# EAGLE design RELAY16 (EAGLE 9.3.1)
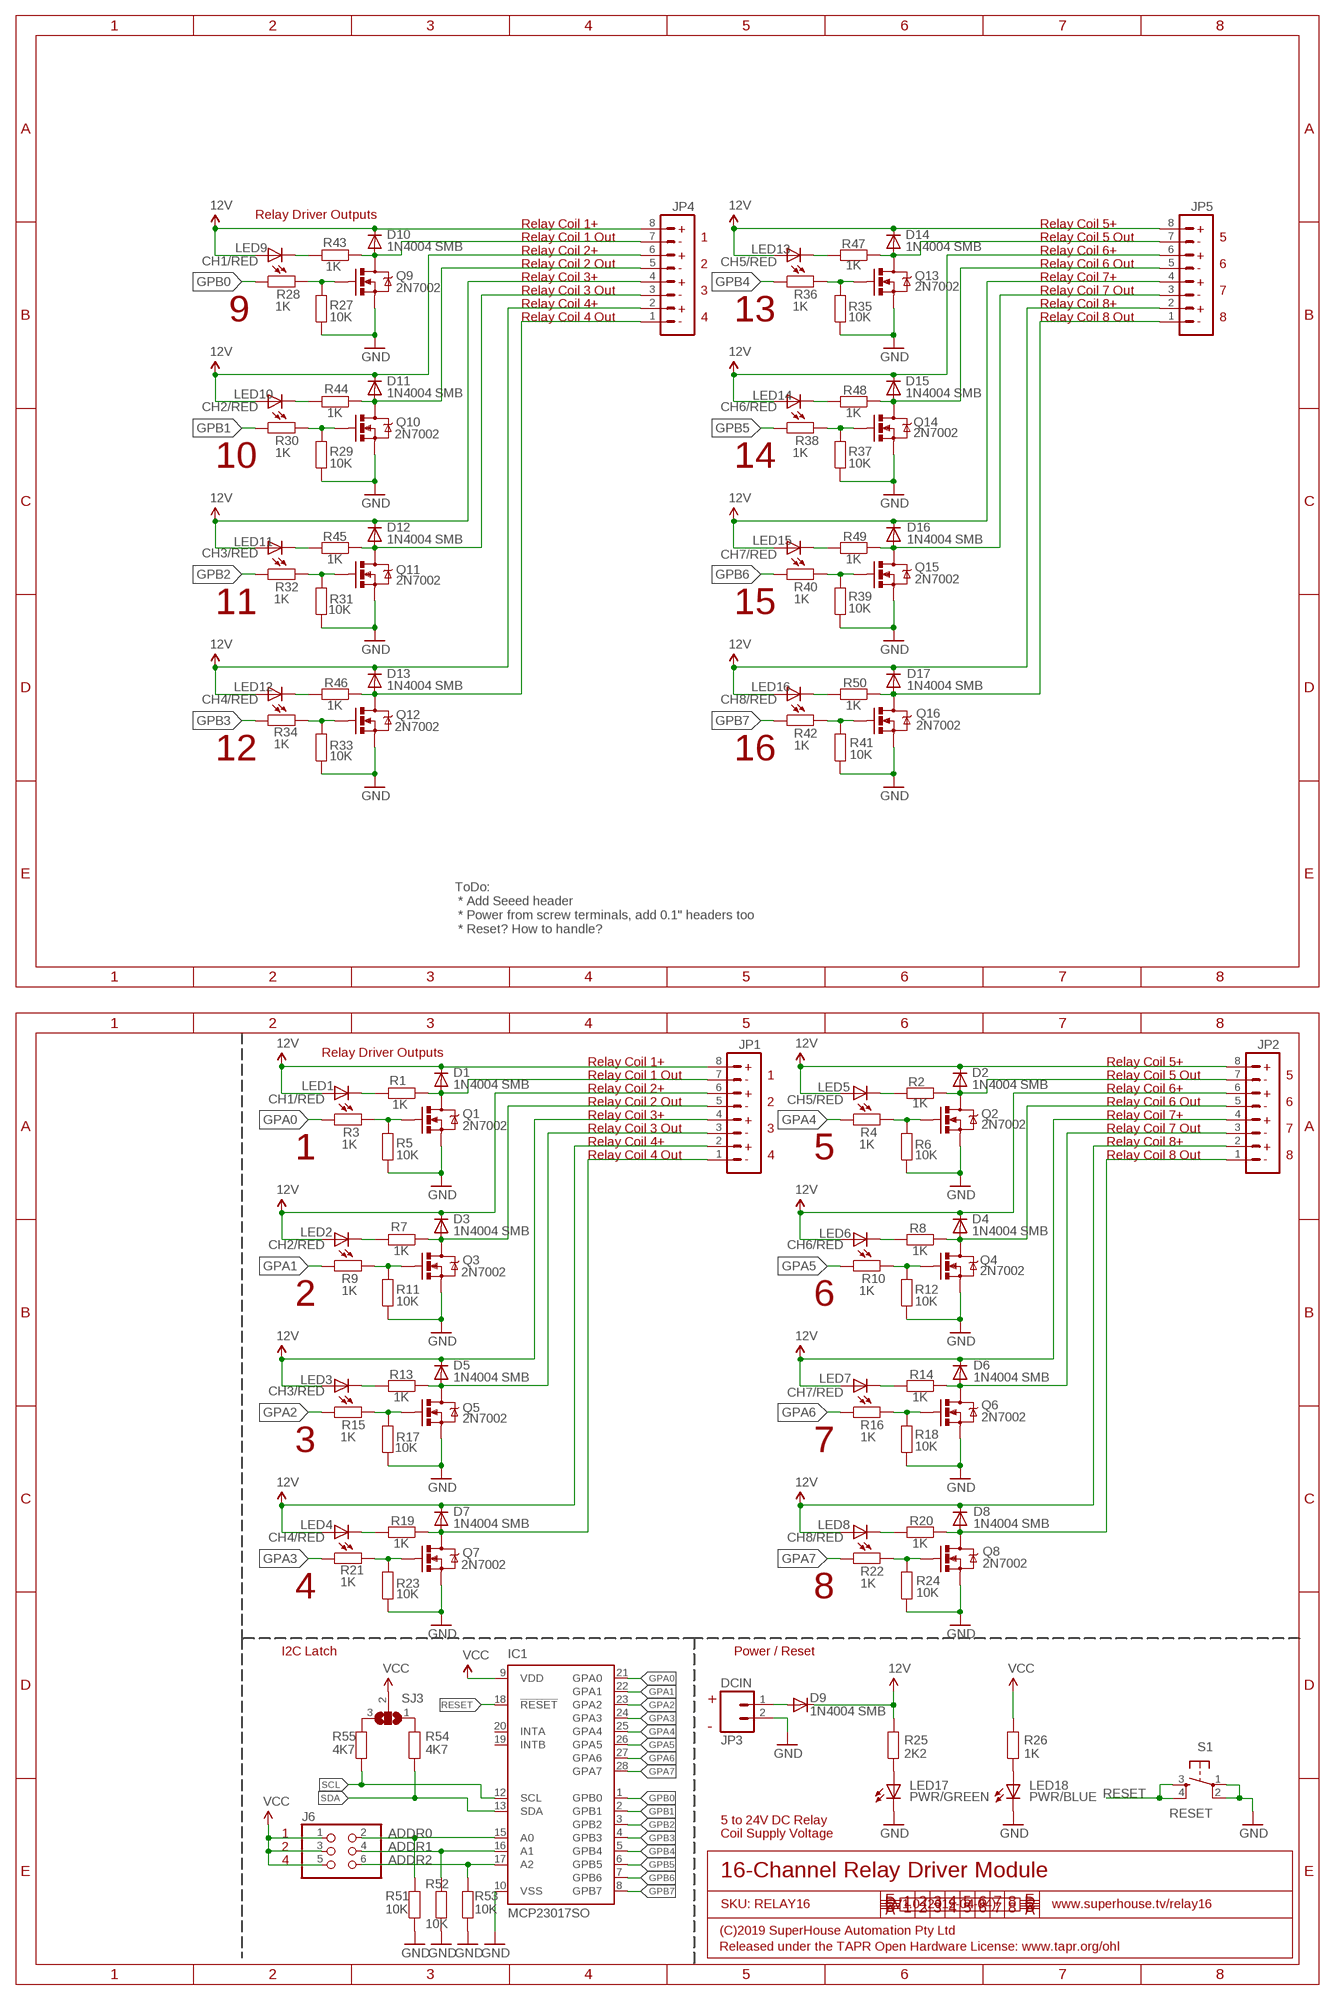
[diagram p0: schematic, sheet 1]

## Parts
D1  1N4004 SMB  DIODESMB  [SMB-DIODE]
D2  1N4004 SMB  DIODESMB  [SMB-DIODE]
D3  1N4004 SMB  DIODESMB  [SMB-DIODE]
D4  1N4004 SMB  DIODESMB  [SMB-DIODE]
D5  1N4004 SMB  DIODESMB  [SMB-DIODE]
D6  1N4004 SMB  DIODESMB  [SMB-DIODE]
D7  1N4004 SMB  DIODESMB  [SMB-DIODE]
D8  1N4004 SMB  DIODESMB  [SMB-DIODE]
D9  1N4004 SMB  DIODESMB  [SMB-DIODE]
D10  1N4004 SMB  DIODESMB  [SMB-DIODE]
D11  1N4004 SMB  DIODESMB  [SMB-DIODE]
D12  1N4004 SMB  DIODESMB  [SMB-DIODE]
D13  1N4004 SMB  DIODESMB  [SMB-DIODE]
D14  1N4004 SMB  DIODESMB  [SMB-DIODE]
D15  1N4004 SMB  DIODESMB  [SMB-DIODE]
D16  1N4004 SMB  DIODESMB  [SMB-DIODE]
D17  1N4004 SMB  DIODESMB  [SMB-DIODE]
IC1  MCP23017SO  [SO28W]
J6  PINHD-2X3  [2X03]
JP1  M08  [TERMINALBLOCK_3.5MM_8]
JP2  M08  [TERMINALBLOCK_3.5MM_8]
JP3  DCIN  M023.5MM  [SCREWTERMINAL-3.5MM-2]
JP4  M08  [TERMINALBLOCK_3.5MM_8]
JP5  M08  [TERMINALBLOCK_3.5MM_8]
LED1  CH1/RED  LED0603  [LED-0603]
LED2  CH2/RED  LED0603  [LED-0603]
LED3  CH3/RED  LED0603  [LED-0603]
LED4  CH4/RED  LED0603  [LED-0603]
LED5  CH5/RED  LED0603  [LED-0603]
LED6  CH6/RED  LED0603  [LED-0603]
LED7  CH7/RED  LED0603  [LED-0603]
LED8  CH8/RED  LED0603  [LED-0603]
LED9  CH1/RED  LED0603  [LED-0603]
LED10  CH2/RED  LED0603  [LED-0603]
LED11  CH3/RED  LED0603  [LED-0603]
LED12  CH4/RED  LED0603  [LED-0603]
LED13  CH5/RED  LED0603  [LED-0603]
LED14  CH6/RED  LED0603  [LED-0603]
LED15  CH7/RED  LED0603  [LED-0603]
LED16  CH8/RED  LED0603  [LED-0603]
LED17  PWR/GREEN  LED0603  [LED-0603]
LED18  PWR/BLUE  LED0603  [LED-0603]
Q1  2N7002  MOSFET-NCHANNELSMD  [SOT23-3]
Q2  2N7002  MOSFET-NCHANNELSMD  [SOT23-3]
Q3  2N7002  MOSFET-NCHANNELSMD  [SOT23-3]
Q4  2N7002  MOSFET-NCHANNELSMD  [SOT23-3]
Q5  2N7002  MOSFET-NCHANNELSMD  [SOT23-3]
Q6  2N7002  MOSFET-NCHANNELSMD  [SOT23-3]
Q7  2N7002  MOSFET-NCHANNELSMD  [SOT23-3]
Q8  2N7002  MOSFET-NCHANNELSMD  [SOT23-3]
Q9  2N7002  MOSFET-NCHANNELSMD  [SOT23-3]
Q10  2N7002  MOSFET-NCHANNELSMD  [SOT23-3]
Q11  2N7002  MOSFET-NCHANNELSMD  [SOT23-3]
Q12  2N7002  MOSFET-NCHANNELSMD  [SOT23-3]
Q13  2N7002  MOSFET-NCHANNELSMD  [SOT23-3]
Q14  2N7002  MOSFET-NCHANNELSMD  [SOT23-3]
Q15  2N7002  MOSFET-NCHANNELSMD  [SOT23-3]
Q16  2N7002  MOSFET-NCHANNELSMD  [SOT23-3]
R1  1K  RESISTOR0603  [0603]
R2  1K  RESISTOR0603  [0603]
R3  1K  RESISTOR0603  [0603]
R4  1K  RESISTOR0603  [0603]
R5  10K  RESISTOR0603  [0603]
R6  10K  RESISTOR0603  [0603]
R7  1K  RESISTOR0603  [0603]
R8  1K  RESISTOR0603  [0603]
R9  1K  RESISTOR0603  [0603]
R10  1K  RESISTOR0603  [0603]
R11  10K  RESISTOR0603  [0603]
R12  10K  RESISTOR0603  [0603]
R13  1K  RESISTOR0603  [0603]
R14  1K  RESISTOR0603  [0603]
R15  1K  RESISTOR0603  [0603]
R16  1K  RESISTOR0603  [0603]
R17  10K  RESISTOR0603  [0603]
R18  10K  RESISTOR0603  [0603]
R19  1K  RESISTOR0603  [0603]
R20  1K  RESISTOR0603  [0603]
R21  1K  RESISTOR0603  [0603]
R22  1K  RESISTOR0603  [0603]
R23  10K  RESISTOR0603  [0603]
R24  10K  RESISTOR0603  [0603]
R25  2K2  RESISTOR0603  [0603]
R26  1K  RESISTOR0603  [0603]
R27  10K  RESISTOR0603  [0603]
R28  1K  RESISTOR0603  [0603]
R29  10K  RESISTOR0603  [0603]
R30  1K  RESISTOR0603  [0603]
R31  10K  RESISTOR0603  [0603]
R32  1K  RESISTOR0603  [0603]
R33  10K  RESISTOR0603  [0603]
R34  1K  RESISTOR0603  [0603]
R35  10K  RESISTOR0603  [0603]
R36  1K  RESISTOR0603  [0603]
R37  10K  RESISTOR0603  [0603]
R38  1K  RESISTOR0603  [0603]
R39  10K  RESISTOR0603  [0603]
R40  1K  RESISTOR0603  [0603]
R41  10K  RESISTOR0603  [0603]
R42  1K  RESISTOR0603  [0603]
R43  1K  RESISTOR0603  [0603]
R44  1K  RESISTOR0603  [0603]
R45  1K  RESISTOR0603  [0603]
R46  1K  RESISTOR0603  [0603]
R47  1K  RESISTOR0603  [0603]
R48  1K  RESISTOR0603  [0603]
R49  1K  RESISTOR0603  [0603]
R50  1K  RESISTOR0603  [0603]
R51  10K  RESISTOR0603  [0603]
R52  10K  RESISTOR0603  [0603]
R53  10K  RESISTOR0603  [0603]
R54  4K7  RESISTOR0603  [0603]
R55  4K7  RESISTOR0603  [0603]
S1  RESET  TAC_SWITCHSMD  [TACTILE_SWITCH_SMD]
SJ3  SJ2W  [SJ_2]

## Nets
12V: D1.C D2.C D3.C D4.C D5.C D6.C D7.C D8.C D9.C D10.C D11.C D12.C D13.C D14.C D15.C D16.C D17.C JP1.2 JP1.4 JP1.6 JP1.8 JP2.2 JP2.4 JP2.6 JP2.8 JP4.2 JP4.4 JP4.6 JP4.8 JP5.2 JP5.4 JP5.6 JP5.8 LED1.A LED2.A LED3.A LED4.A LED5.A LED6.A LED7.A LED8.A LED9.A LED10.A LED11.A LED12.A LED13.A LED14.A LED15.A LED16.A R25.2
ADDR0: IC1.15(A0) J6.2 R51.2
ADDR1: IC1.16(A1) J6.4 R52.2
ADDR2: IC1.17(A2) J6.6 R53.2
GND: IC1.10(VSS) JP3.2 LED17.C LED18.C Q1.2(S) Q2.2(S) Q3.2(S) Q4.2(S) Q5.2(S) Q6.2(S) Q7.2(S) Q8.2(S) Q9.2(S) Q10.2(S) Q11.2(S) Q12.2(S) Q13.2(S) Q14.2(S) Q15.2(S) Q16.2(S) R5.1 R6.1 R11.1 R12.1 R17.1 R18.1 R23.1 R24.1 R27.1 R29.1 R31.1 R33.1 R35.1 R37.1 R39.1 R41.1 R51.1 R52.1 R53.1 S1.1 S1.2
GPA0: IC1.21(GPA0) R3.2
GPA1: IC1.22(GPA1) R9.2
GPA2: IC1.23(GPA2) R15.2
GPA3: IC1.24(GPA3) R21.2
GPA4: IC1.25(GPA4) R4.2
GPA5: IC1.26(GPA5) R10.2
GPA6: IC1.27(GPA6) R16.2
GPA7: IC1.28(GPA7) R22.2
GPB0: IC1.1(GPB0) R28.2
GPB1: IC1.2(GPB1) R30.2
GPB2: IC1.3(GPB2) R32.2
GPB3: IC1.4(GPB3) R34.2
GPB4: IC1.5(GPB4) R36.2
GPB5: IC1.6(GPB5) R38.2
GPB6: IC1.7(GPB6) R40.2
GPB7: IC1.8(GPB7) R42.2
IOREF: IC1.9(VDD) J6.1 J6.3 J6.5 R26.2 SJ3.2 ; supply symbol labelled VCC
N$1: Q1.1(G) R3.1 R5.2
N$2: R55.2 SJ3.3
N$3: D3.A JP1.5 Q3.3(D) R7.2
N$4: LED17.A R25.1
N$5: D1.A JP1.7 Q1.3(D) R1.2
N$6: R54.2 SJ3.1
N$8: Q3.1(G) R9.1 R11.2
N$9: D5.A JP1.3 Q5.3(D) R13.2
N$10: Q5.1(G) R15.1 R17.2
N$11: D7.A JP1.1 Q7.3(D) R19.2
N$12: Q7.1(G) R21.1 R23.2
N$13: D2.A JP2.7 Q2.3(D) R2.2
N$14: Q2.1(G) R4.1 R6.2
N$15: D4.A JP2.5 Q4.3(D) R8.2
N$16: Q4.1(G) R10.1 R12.2
N$17: D6.A JP2.3 Q6.3(D) R14.2
N$18: Q6.1(G) R16.1 R18.2
N$19: D8.A JP2.1 Q8.3(D) R20.2
N$20: Q8.1(G) R22.1 R24.2
N$21: LED2.C R7.1
N$22: LED4.C R19.1
N$23: LED3.C R13.1
N$24: LED1.C R1.1
N$25: LED5.C R2.1
N$26: LED6.C R8.1
N$27: LED7.C R14.1
N$28: LED8.C R20.1
N$41: D9.A JP3.1
N$42: D10.A JP4.7 Q9.3(D) R43.2
N$43: Q9.1(G) R27.2 R28.1
N$47: D11.A JP4.5 Q10.3(D) R44.2
N$48: Q10.1(G) R29.2 R30.1
N$50: D12.A JP4.3 Q11.3(D) R45.2
N$51: Q11.1(G) R31.2 R32.1
N$52: LED18.A R26.1
N$53: D13.A JP4.1 Q12.3(D) R46.2
N$54: Q12.1(G) R33.2 R34.1
N$55: D14.A JP5.7 Q13.3(D) R47.2
N$56: Q13.1(G) R35.2 R36.1
N$57: D15.A JP5.5 Q14.3(D) R48.2
N$58: Q14.1(G) R37.2 R38.1
N$59: D16.A JP5.3 Q15.3(D) R49.2
N$60: Q15.1(G) R39.2 R40.1
N$61: D17.A JP5.1 Q16.3(D) R50.2
N$62: Q16.1(G) R41.2 R42.1
N$63: LED9.C R43.1
N$64: LED10.C R44.1
N$65: LED11.C R45.1
N$66: LED12.C R46.1
N$67: LED13.C R47.1
N$68: LED14.C R48.1
N$69: LED15.C R49.1
N$70: LED16.C R50.1
RESET: IC1.18(!RESET) S1.3 S1.4
SCL: IC1.12(SCL) R55.1
SDA: IC1.13(SDA) R54.1
Unconnected: IC1.19(INTB) IC1.20(INTA)

## Notes on the sheet
- Relay Driver Outputs
- Relay Coil 1+ | Relay Coil 5+
- + | +
- Relay Coil 1 Out | 1 | Relay Coil 5 Out | 5
- - | -
- Relay Coil 2+ | Relay Coil 6+
- + | +
- Relay Coil 2 Out | 2 | Relay Coil 6 Out | 6
- - | -
- Relay Coil 3+ | Relay Coil 7+
- + | +
- Relay Coil 3 Out | 3 | Relay Coil 7 Out | 7
- - | -
- Relay Coil 4+ | Relay Coil 8+
- + | +
- 9 | Relay Coil 4 Out | 4 | 13 | Relay Coil 8 Out | 8
- - | -
- 10 | 14
- 11 | 15
- 12 | 16
- ToDo:
   * Add Seeed header
   * Power from screw terminals, add 0.1" headers too
   * Reset? How to handle?
- Relay Driver Outputs
- Relay Coil 1+ | Relay Coil 5+
- + | +
- Relay Coil 1 Out | 1 | Relay Coil 5 Out | 5
- - | -
- Relay Coil 2+ | Relay Coil 6+
- + | +
- Relay Coil 2 Out | 2 | Relay Coil 6 Out | 6
- - | -
- Relay Coil 3+ | Relay Coil 7+
- + | +
- Relay Coil 3 Out | 3 | Relay Coil 7 Out | 7
- - | -
- Relay Coil 4+ | Relay Coil 8+
- + | +
- 1 | Relay Coil 4 Out | 4 | 5 | Relay Coil 8 Out | 8
- - | -
- 2 | 6
- 3 | 7
- 4 | 8
- I2C Latch | Power / Reset
- +
- -
- 5 to 24V DC Relay
- 1 | Coil Supply Voltage
- 2
- 4
- 16-Channel Relay Driver Module
- SKU: RELAY16 | V1.0 (2019-04-04) | www.superhouse.tv/relay16
- (C)2019 SuperHouse Automation Pty Ltd
- Released under the TAPR Open Hardware License: www.tapr.org/ohl

## Library data of the parts
D1-D17 = freetronics-master-v1.1:DIODE: Diode These are standard reverse protection diodes and small signal diodes. SMA package can handle up to about 1A. SOD-323 can handle about 200mA. What the SOD-323 package when ordering, there are some mfgs out there that are 5-pin packages.
IC1 = microchip:MCP23017: http://ww1.microchip.com/downloads/en/DeviceDoc/21952a.pdf Source: http://ww1.microchip.com/downloads/en/DeviceDoc/21952a.pdf
J6 = freetronics-master-v1.1:PINHD-2X3: PIN HEADER
JP1 JP2 JP4 JP5 = freetronics-master-v1:M08: Header 8 Standard 8-pin 0.1" header. Use with straight break away headers (SKU : PRT-00116), right angle break away headers (PRT-00553), swiss pins (PRT-00743), machine pins (PRT-00117), and female headers (PRT-00115).
JP3 = freetronics-master-v1.1:M02: Header 2 Standard 2-pin 0.1" header. Use with straight break away headers (SKU : PRT-00116), right angle break away headers (PRT-00553), swiss pins (PRT-00743), machine pins (PRT-00117), and female headers (PRT-00115). Molex polarized connector foot print use with SKU : PRT-08233 with associated crimp pins and housings.
LED1-LED18 = freetronics-master-v1:LED: LEDs Standard schematic elements and footprints for 5mm, 3mm, 1206, and 0603 sized LEDs. 5mm - Spark Fun Electronics SKU : COM-00529 (and others)
Q1-Q16 = freetronics-master-v1:MOSFET-NCHANNEL
R1-R55 = freetronics-master-v1:RESISTOR: Resistor Basic schematic elements and footprints for 0603, 1206, and PTH 1/10th watt (small) resistors.
S1 = freetronics-original:TAC_SWITCH: Momentary Switch Button commonly used for reset or general input. Spark Fun Electronics SKU : COM-00097
SJ3 = freetronics-master-v1.1:SJ2W: SMD solder JUMPER

## Board
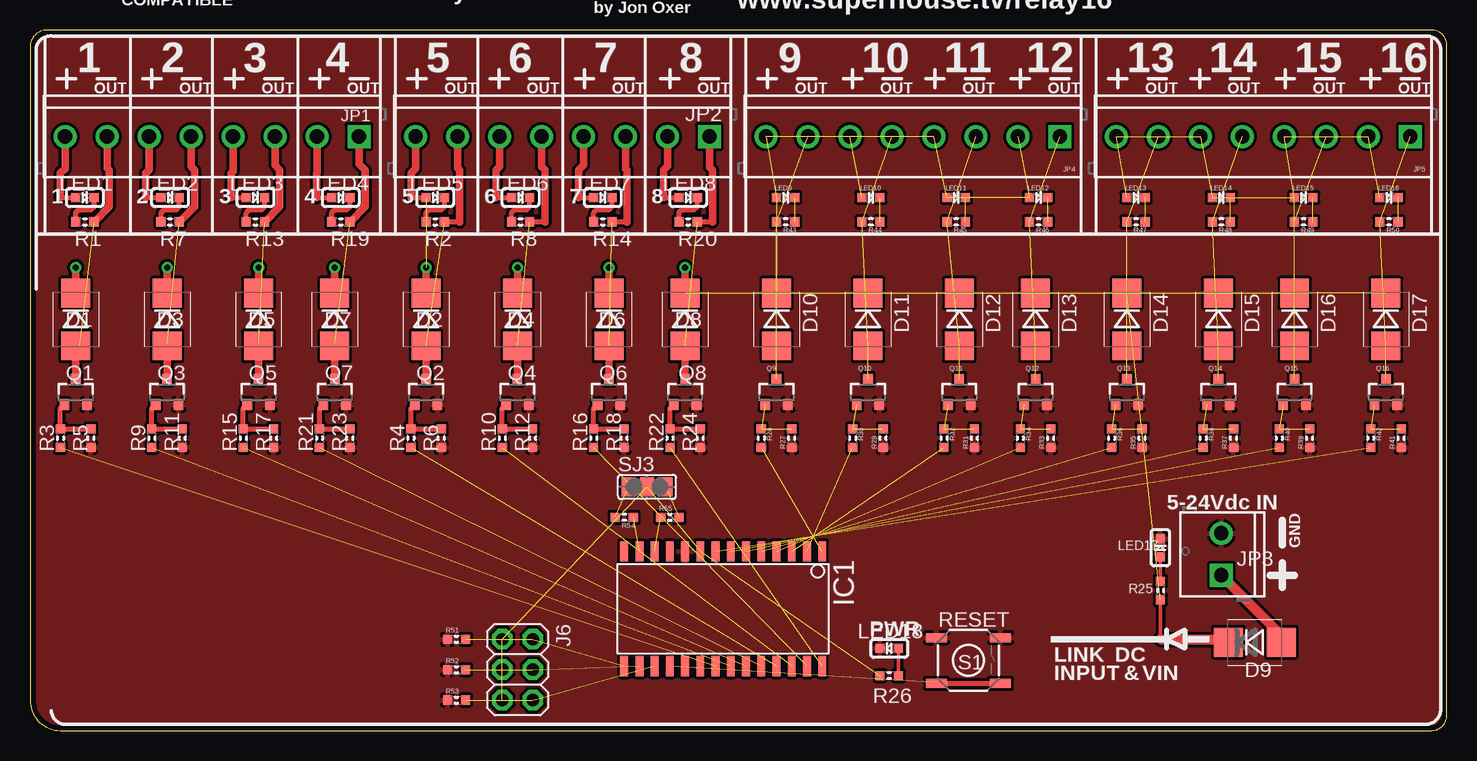
[diagram p1: board, top side]
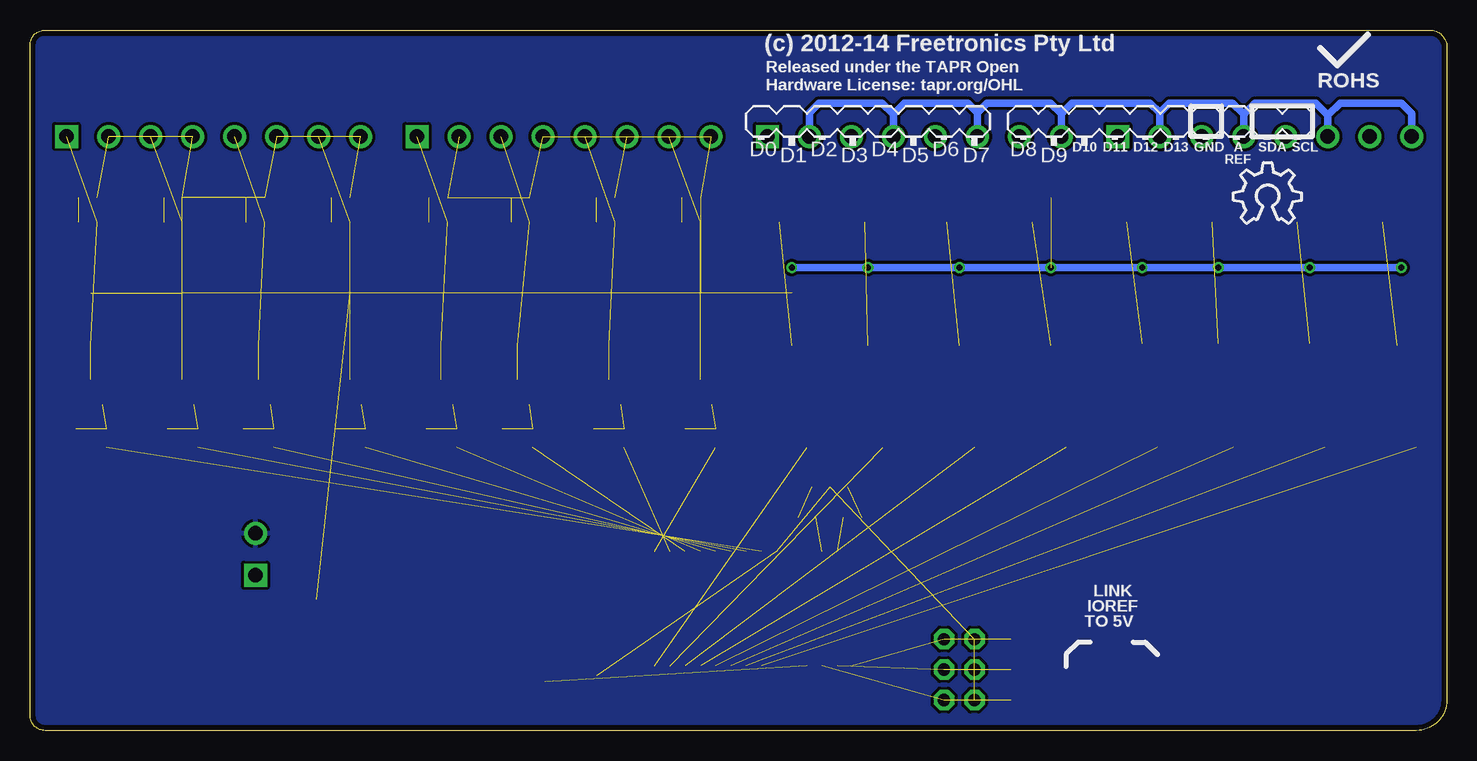
[diagram p2: board, bottom side, seen from below]

Size 118.11 x 58.42 mm. Coordinates in mm from the lower left corner, seen from the top.
Outline: 0,2.54 arc90 2.54,0 116.84,0 arc90 118.11,1.27 118.11,57.15 arc90 116.84,58.42 1.27,58.42 arc74 0,57.15 0,2.54
Copper layers (1*16): Top 0.035mm / dielectric 1.5mm / Bottom 0.035mm
Design rules "default *": minimum track width 10mil, minimum drill 19mil, track to track 10mil, track to pad 12mil, pad to pad 12mil, via to via 12mil, smd to smd 8mil, copper to edge 18mil, drill to drill 8mil, minimum pad ring 14mil, minimum via ring 8mil, stop-mask expansion 4mil, vias tented up to drill 0mil, thermal gap 10mil

### Footprints (pad centres in the part's own frame; a part is rotated, then mirrored left to right if it is on the bottom)
SMB-DIODE = smd 2.4 x 2.4: A 2.2,0; C -2.2,0
SO28W = smd 0.65 x 1.7: 1 -7.62,-4.78; 2 -6.35,-4.78; 3 -5.08,-4.78; 4 -3.81,-4.78; 5 -2.54,-4.78; 6 -1.27,-4.78; 7 0,-4.78; 8 1.27,-4.78; 9 2.54,-4.78; 10 3.81,-4.78; 11 5.08,-4.78; 12 6.35,-4.78; 13 7.62,-4.78; 14 8.89,-4.78; 15 8.89,4.78; 16 7.62,4.78; 17 6.35,4.78; 18 5.08,4.78; 19 3.81,4.78; 20 2.54,4.78; 21 1.27,4.78; 22 0,4.78; 23 -1.27,4.78; 24 -2.54,4.78; 25 -3.81,4.78; 26 -5.08,4.78; 27 -6.35,4.78; 28 -7.62,4.78
2X03 = drill 1.016 octagon: 1 -2.54,-1.27; 2 -2.54,1.27; 3 0,-1.27; 4 0,1.27; 5 2.54,-1.27; 6 2.54,1.27
TERMINALBLOCK_3.5MM_8 = drill 1.2 square: 1 0,0 | drill 1.2: 2 3.5,0; 3 7,0; 4 10.5,0; 5 14,0; 6 17.5,0; 7 21,0; 8 24.5,0
SCREWTERMINAL-3.5MM-2 = drill 1.2 square: 1 0,0 | drill 1.2: 2 3.5,0
LED-0603 = smd 0.762 x 0.762: A -0.762,0; C 0.762,0
SOT23-3 = smd 0.8 x 0.9: 1 -0.95,-1; 2 0.95,-1; 3 0,1.1
0603 = smd 0.762 x 0.762: 1 -0.762,0; 2 0.762,0
TACTILE_SWITCH_SMD = smd 1.778 x 0.762: 1 -2.667,1.905; 2 2.667,1.905; 3 -2.667,-1.905; 4 2.667,-1.905
SJ_2 = smd 1.168 x 1.6: 1 -1.524,0; 2 0,0; 3 1.524,0

### Placement (x,y rotation side)
D1  3.81,34.29 270 top
D2  33.02,34.29 270 top
D3  11.43,34.29 270 top
D4  40.64,34.29 270 top
D5  19.05,34.29 270 top
D6  48.26,34.29 270 top
D7  25.4,34.29 270 top
D8  54.61,34.29 270 top
D9  102.11,7.37 0 top
D10  62.23,34.29 270 top
D11  69.85,34.29 270 top
D12  77.47,34.29 270 top
D13  83.82,34.29 270 top
D14  91.44,34.29 270 top
D15  99.06,34.29 270 top
D16  105.41,34.29 270 top
D17  113.03,34.29 270 top
IC1  58.42,10.16 180 top
J6  40.64,5.08 270 top
JP1  27.43,49.53 180 top
JP2  56.64,49.53 180 top
JP3  99.31,12.95 90 top
JP4  85.85,49.53 180 top
JP5  115.06,49.53 180 top
LED1  4.57,44.45 0 top
LED2  11.68,44.45 0 top
LED3  18.8,44.45 0 top
LED4  25.91,44.45 0 top
LED5  33.78,44.45 0 top
LED6  40.89,44.45 0 top
LED7  47.75,44.45 0 top
LED8  54.86,44.45 0 top
LED9  62.99,44.45 0 top
LED10  70.1,44.45 0 top
LED11  77.22,44.45 0 top
LED12  84.07,44.45 0 top
LED13  92.2,44.45 0 top
LED14  99.31,44.45 0 top
LED15  106.17,44.45 0 top
LED16  113.28,44.45 0 top
LED17  94.23,15.24 90 top
LED18  71.63,6.86 180 top
Q1  3.81,28.19 0 top
Q2  33.02,28.19 0 top
Q3  11.43,28.19 0 top
Q4  40.64,28.19 0 top
Q5  19.05,28.19 0 top
Q6  48.26,28.19 0 top
Q7  25.4,28.19 0 top
Q8  54.61,28.19 0 top
Q9  62.23,28.19 0 top
Q10  69.85,28.19 0 top
Q11  77.47,28.19 0 top
Q12  83.82,28.19 0 top
Q13  91.44,28.19 0 top
Q14  99.06,28.19 0 top
Q15  105.41,28.19 0 top
Q16  113.03,28.19 0 top
R1  4.57,42.42 0 top
R2  33.78,42.42 0 top
R3  2.54,24.38 270 top
R4  31.75,24.38 270 top
R5  5.08,24.38 90 top
R6  34.29,24.38 90 top
R7  11.68,42.42 0 top
R8  40.89,42.42 0 top
R9  10.16,24.38 270 top
R10  39.37,24.38 270 top
R11  12.7,24.38 90 top
R12  41.91,24.38 90 top
R13  18.8,42.42 0 top
R14  47.75,42.42 0 top
R15  17.78,24.38 270 top
R16  46.99,24.38 270 top
R17  20.32,24.38 90 top
R18  49.53,24.38 90 top
R19  25.91,42.42 0 top
R20  54.86,42.42 0 top
R21  24.13,24.38 270 top
R22  53.34,24.38 270 top
R23  26.67,24.38 90 top
R24  55.88,24.38 90 top
R25  94.23,11.68 270 top
R26  71.63,4.57 180 top
R27  63.5,24.38 90 top
R28  60.96,24.38 270 top
R29  71.12,24.38 90 top
R30  68.58,24.38 270 top
R31  78.74,24.38 90 top
R32  76.2,24.38 270 top
R33  85.09,24.38 90 top
R34  82.55,24.38 270 top
R35  92.71,24.38 90 top
R36  90.17,24.38 270 top
R37  100.33,24.38 90 top
R38  97.79,24.38 270 top
R39  106.68,24.38 90 top
R40  104.14,24.38 270 top
R41  114.3,24.38 90 top
R42  111.76,24.38 270 top
R43  62.99,42.42 180 top
R44  70.1,42.42 180 top
R45  77.22,42.42 180 top
R46  84.07,42.42 180 top
R47  92.2,42.42 180 top
R48  99.31,42.42 180 top
R49  106.17,42.42 180 top
R50  113.28,42.42 180 top
R51  35.56,7.62 0 top
R52  35.56,5.08 0 top
R53  35.56,2.54 0 top
R54  49.53,17.78 180 top
R55  53.34,17.78 0 top
S1  78.23,5.84 0 top
SJ3  51.44,20.32 0 top
U$6  [OSHW_10X200_NOTEXT]  17.78,42.29 0 bottom

### Tracks (layer width: path | path; a pad name or v marks a point on that pad's centre or on a via)
12V  (via drill 0.5)  (26 unrouted)
  Top 0.305: R25.2 94.23,7.62
  Top 0.406: 2.54,44.45 LED1.A | 9.65,44.45 LED2.A | 16.76,44.45 LED3.A | 23.88,44.45 LED4.A | 31.75,44.45 LED5.A | 38.86,44.45 LED6.A | 52.83,44.45 LED8.A | 45.72,44.45 LED7.A
  Top 0.61: 2.54,44.45 2.54,46.48 2.93,46.87 JP1.8 | 9.65,44.45 9.65,46.48 9.93,46.76 JP1.6 | 16.76,44.45 16.76,46.48 16.93,46.65 JP1.4 | 23.88,44.45 23.88,46.48 23.93,46.54 JP1.2 | 31.75,44.45 31.75,46.48 32.14,46.87 JP2.8 | 52.83,44.45 52.83,46.74 53.14,47.05 JP2.2 | 45.72,44.45 45.72,46.74 46.14,47.16 JP2.4 | 38.86,44.45 38.86,46.74 39.14,47.02 JP2.6 | v3.81,38.61 D1.C | v11.43,38.61 D3.C | v19.05,38.61 D5.C | v25.4,38.61 D7.C | v33.02,38.61 D2.C | v40.64,38.61 D4.C | v48.26,38.61 D6.C | v54.61,38.61 D8.C
  Top 0.813: D9.C 99.65,7.62 94.23,7.62
  Bottom 0.61: JP1.8 2.93,51.45 3.81,52.32 8.89,52.32 9.91,51.31 | 9.91,51.31 9.91,49.56 JP1.6 | 16.93,51.39 JP1.4 | 16.93,51.39 16,52.32 10.92,52.32 9.91,51.31 | 23.93,51.51 JP1.2 | 23.93,51.51 23.11,52.32 17.86,52.32 16.93,51.39 | 32.14,51.42 JP2.8 | 32.14,51.42 31.24,52.32 24.75,52.32 23.93,51.51 | JP2.6 39.14,51.54 | 39.14,51.54 38.35,52.32 33.04,52.32 32.14,51.42 | 46.14,51.39 JP2.4 | 46.14,51.39 45.21,52.32 39.93,52.32 39.14,51.54 | JP2.2 53.14,51.51 52.32,52.32 47.07,52.32 46.14,51.39 | v3.81,38.61 v11.43,38.61 v19.05,38.61 v25.4,38.61 v33.02,38.61 v40.64,38.61 v48.26,38.61 v54.61,38.61
ADDR0  (2 unrouted)
ADDR1  (2 unrouted)
ADDR2  (2 unrouted)
GND
  pour Bottom: 0,57.15 arc-74 1.27,58.42 116.84,58.42 arc-74 118.11,57.15 118.11,1.27 arc-74 116.84,0 2.54,0 arc-90 0,2.54
  pour Top: 0,57.15 arc-74 1.27,58.42 116.84,58.42 arc-74 118.08,57.18 117.91,0 2.54,0 arc-90 0,2.54
GPA0  (1 unrouted)
GPA1  (1 unrouted)
GPA2  (1 unrouted)
GPA3  (1 unrouted)
GPA4  (1 unrouted)
GPA5  (1 unrouted)
GPA6  (1 unrouted)
GPA7  (1 unrouted)
GPB0  (1 unrouted)
GPB1  (1 unrouted)
GPB2  (1 unrouted)
GPB3  (1 unrouted)
GPB4  (1 unrouted)
GPB5  (1 unrouted)
GPB6  (1 unrouted)
GPB7  (1 unrouted)
IOREF  (5 unrouted)
N$1
  Top 0.406: R5.2 R3.1 2.54,26.87 Q1.1 2.79,27.13
N$2  (1 unrouted)
N$3  (1 unrouted)
  Top 0.61: Q3.3 D3.A 11.43,32.26 | R7.2 13.72,43.69 13.72,46.74 13.43,47.02 JP1.5
N$4
  Top 0.305: R25.1 LED17.A
N$5  (1 unrouted)
  Top 0.61: Q1.3 D1.A 4.15,32.09 | R1.2 6.6,43.69 6.6,46.74 6.43,46.91 JP1.7
N$6  (1 unrouted)
N$8
  Top 0.406: R11.2 R9.1 10.16,26.87 Q3.1 10.41,27.13
N$9  (1 unrouted)
  Top 0.61: Q5.3 D5.A 19.05,32.26 | R13.2 20.83,43.69 20.83,46.74 20.43,47.13 JP1.3
N$10
  Top 0.406: R17.2 R15.1 17.78,26.87 Q5.1 18.03,27.13
N$11  (1 unrouted)
  Top 0.61: Q7.3 D7.A 25.4,32.26 | R19.2 27.94,43.69 27.94,46.74 27.43,47.24 JP1.1
N$12
  Top 0.406: R23.2 R21.1 24.13,26.87 Q7.1 24.38,27.13
N$13  (1 unrouted)
  Top 0.406: 35.81,42.42 R2.2
  Top 0.61: 35.81,42.42 35.81,46.74 35.64,46.91 JP2.7 | Q2.3 D2.A
N$14
  Top 0.406: R6.2 R4.1 31.75,26.87 Q2.1
N$15  (1 unrouted)
  Top 0.406: 42.93,42.42 R8.2
  Top 0.61: 42.93,42.42 42.93,46.74 42.64,47.02 JP2.5 | Q4.3 D4.A
N$16
  Top 0.406: R12.2 R10.1 39.37,26.87 Q4.1
N$17  (1 unrouted)
  Top 0.406: 49.78,42.42 R14.2
  Top 0.61: Q6.3 D6.A 48.35,32.09 | 49.78,42.42 49.78,46.74 49.64,46.88 JP2.3
N$18
  Top 0.406: R18.2 R16.1 46.99,26.87 Q6.1
N$19  (1 unrouted)
  Top 0.406: 56.9,42.42 R20.2
  Top 0.61: Q8.3 D8.A 54.7,32.09 | 56.9,42.42 56.9,46.74 56.64,46.99 JP2.1
N$20
  Top 0.406: R24.2 R22.1 53.34,26.87 Q8.1
N$21
  Top 0.406: R7.1 10.92,43.18 11.18,43.43 12.19,43.43 12.45,43.69 LED2.C
N$22
  Top 0.406: R19.1 25.15,43.18 25.4,43.43 26.42,43.43 26.67,43.69 LED4.C
N$23
  Top 0.406: R13.1 18.03,43.18 18.29,43.43 19.3,43.43 19.56,43.69 LED3.C
N$24
  Top 0.406: R1.1 3.81,43.18 4.06,43.43 5.08,43.43 5.33,43.69 LED1.C
N$25
  Top 0.406: R2.1 33.02,43.18 33.27,43.43 34.29,43.43 34.54,43.69 LED5.C
N$26
  Top 0.406: R8.1 40.13,43.18 40.39,43.43 41.4,43.43 41.66,43.69 LED6.C
N$27
  Top 0.406: R14.1 46.99,43.18 47.24,43.43 48.26,43.43 48.51,43.69 LED7.C
N$28
  Top 0.406: R20.1 54.1,43.18 54.36,43.43 55.37,43.43 55.63,43.69 LED8.C
N$41
  Top 0.813: 99.48,12.95 JP3.1 104.31,7.96 D9.A
N$42  (3 unrouted)
N$43  (2 unrouted)
N$47  (3 unrouted)
N$48  (2 unrouted)
N$50  (3 unrouted)
N$51  (2 unrouted)
N$52
  Top 0.305: LED18.A R26.1
N$53  (3 unrouted)
N$54  (2 unrouted)
N$55  (3 unrouted)
N$56  (2 unrouted)
N$57  (3 unrouted)
N$58  (2 unrouted)
N$59  (3 unrouted)
N$60  (2 unrouted)
N$61  (3 unrouted)
N$62  (2 unrouted)
N$63  (1 unrouted)
N$64  (1 unrouted)
N$65  (1 unrouted)
N$66  (1 unrouted)
N$67  (1 unrouted)
N$68  (1 unrouted)
N$69  (1 unrouted)
N$70  (1 unrouted)
RESET  (1 unrouted)
  Top 0.406: S1.4 S1.3 75.44,4.06 75.18,4.06
SCL  (1 unrouted)
SDA  (1 unrouted)

### Text on the board
tPlace: 5V | 3.3V | 16-Channel Relay Driver Module | COMPATIBLE | by Jon Oxer | www.superhouse.tv/relay16 | 1 | 2 | 3 | 4 | 5 | 6 | 7 | 8 | 9 | 10 | 11 | 12 | 13 | 14 | 15 | 16 | OUT | OUT | OUT | OUT | OUT | OUT | OUT | OUT | OUT | OUT | OUT | OUT | OUT | OUT | OUT | OUT | 1 | 2 | 3 | 4 | 5 | 6 | 7 | 8 | 5-24Vdc IN | GND | RESET | PWR | LINK | DC | INPUT | & | VIN
bPlace: 8-Channel Relay Driver Shield v2.0 | SKU: RELAY8 | www.freetronics.com/relay8 | (c) 2012-14 Freetronics Pty Ltd | ROHS | Released under the TAPR Open / Hardware License: tapr.org/OHL | SCL | SDA | A | GND | D13 | D12 | D11 | D10 | D8 | D6 | D4 | D2 | D0 | REF | D9 | D7 | D5 | D3 | D1 | LINK | IOREF | TO 5V
tDocu: A | K | A | K | A | K | A | K | A | K | A | K | A | K | A | K | K | A | K | A | K | A